# Altium schematic sheet Altium_STM32_Schematic_SchDoc.SchDoc
size A4; SheetNumber: 2; SheetTotal: 3
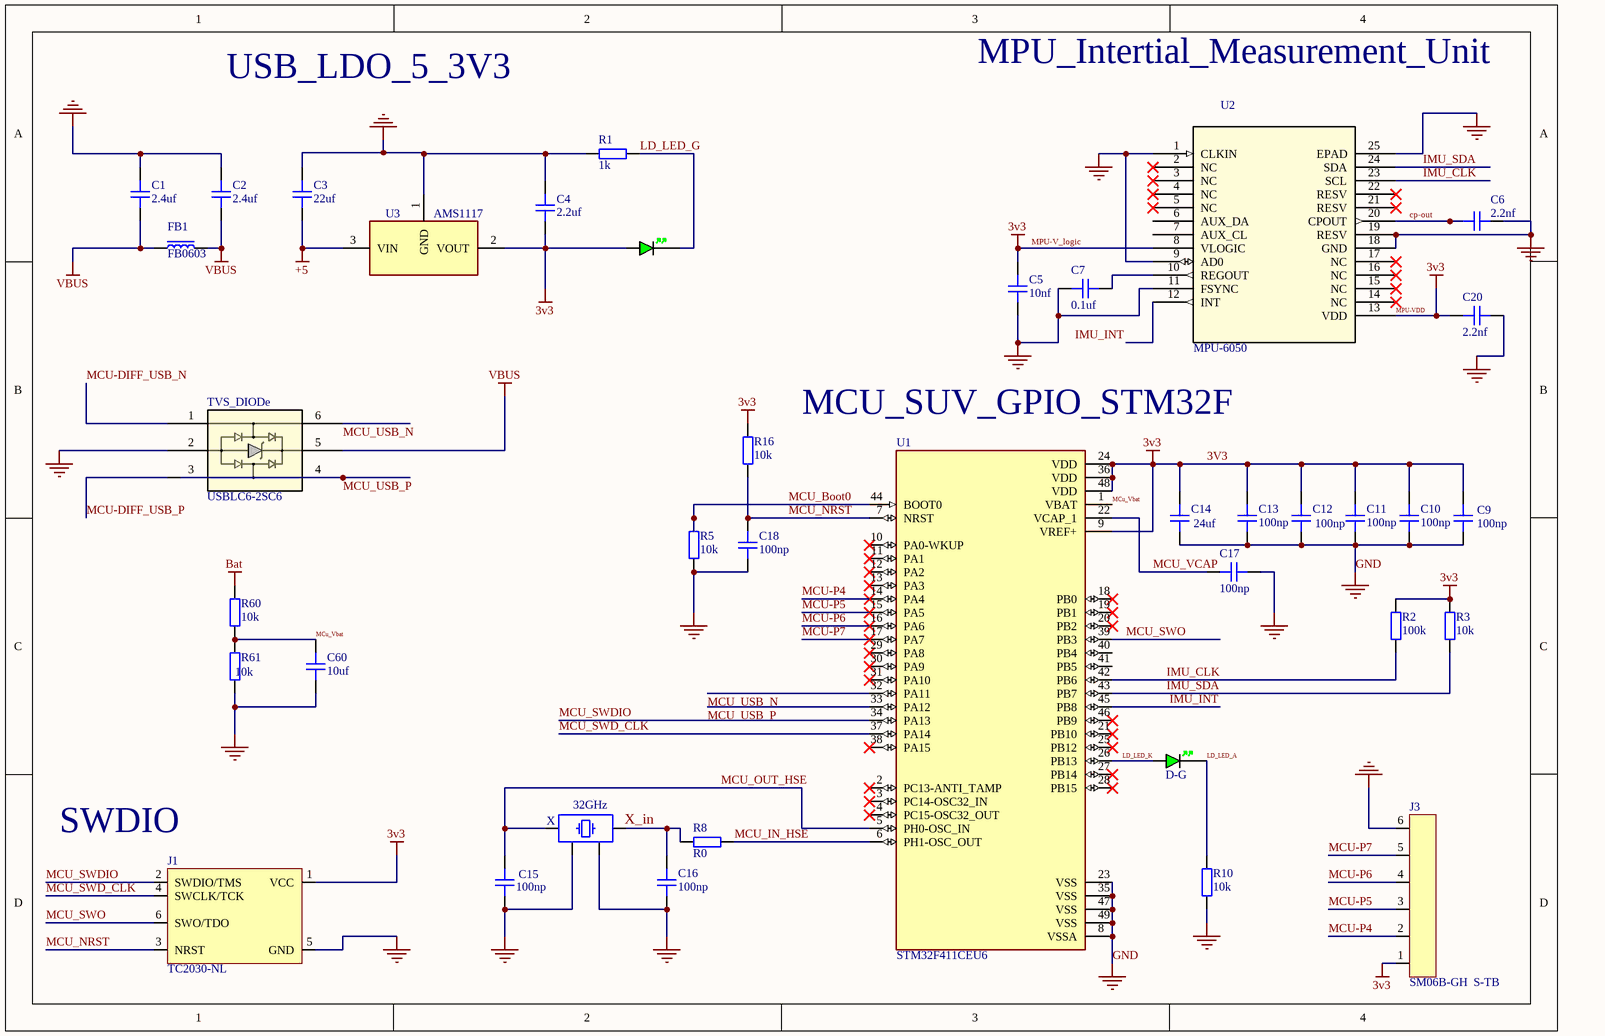
[diagram p0: Altium_STM32_Schematic_SchDoc.SchDoc]

## Parts
C1  2.4uf  [CAP_0603]
C2  2.4uf  [CAP_0603]
C3  22uf  [CAP_0805]
C4  2.2uf  [CAP_0805]
C5  10nf  [CAP_0603]
C6  2.2nf  [CAP_0603]
C7  0.1uf  [CAP_0603]
C9  100np  [CAP_0402]
C10  100np  [CAP_0402]
C11  100np  [CAP_0402]
C12  100np  [CAP_0402]
C13  100np  [CAP_0402]
C14  24uf  [CAP_0603]
C15  100np  [CAP_0402]
C16  100np  [CAP_0402]
C17  100np  [CAP_0402]
C18  100np  [CAP_0402]
C20  2.2nf  [CAP_0603]
C60  10uf  [CAP_0402]
D  GREEN  [LED_0402_GREEN]  (value not drawn)
D-G  GREEN  [LED_0402_GREEN]  (value not drawn)
FB1  FB0603  [FB_0603]
J1  TC2030-NL  [TC2030-NL-FP]  (no BOM)
J3  SM06B-GH  S-TB  [SM06B-GHS-TB]
R1  1k  [RES_0402]
R2  100k  [RES_0402]
R3  10k  [RES_0402]
R5  10k  [RES_0402]
R8  R0  [RES_0402]
R10  10k  [RES_0402]
R16  10k  [RES_0402]
R60  10k  [RES_0402]
R61  10k  [RES_0402]
TVS_DIODe  USBLC6-2SC6  [SOT23-6L_STM]
U1  STM32F411CEU6  [QFN50P700X700X60-49N]
U2  MPU-6050  [QFN24_4X4X0P9-0P5_TDK]
U3  AMS1117  [AMS1117]
X  32GHz  [XTAL_2016]

## Nets
3V3: C4.2 C5.2 C9.2 C10.2 C11.2 C12.2 C13.2 C14.2 C20.2 D.A J1.1(VCC) J3.1 R2.2 R3.2 R16.2 U1.9(VREF+) U1.24(VDD) U1.36(VDD) U1.48(VDD) U2.8(VLOGIC) U2.13(VDD) U3.2(VOUT)  [also labelled MPU-V_logic, MPU-VDD]
+5: C3.1 U3.3(VIN)
Bat: R60.2
GND: C1.2 C2.2 C3.2 C4.1 C5.1 C6.1 C7.1 C9.1 C10.1 C11.1 C12.1 C13.1 C14.1 C15.1 C16.1 C17.1 C18.2 C20.1 C60.1 J1.5(GND) J3.6 R1.1 R5.1 R10.2 R61.2 TVS_DIODe.2 U1.8(VSSA) U1.23(VSS) U1.35(VSS) U1.47(VSS) U1.49(VSS) U2.1(CLKIN) U2.9(AD0) U2.11(FSYNC) U2.18(GND) U2.19(RESV) U2.25(EPAD) U3.1(GND) X.2 X.4
VBUS: C1.1 C2.1 FB1.1 FB1.2 TVS_DIODe.5
cp-out: C6.2 U2.20(CPOUT)
IMU_CLK: R2.1 U1.42(PB6) U2.23(SCL)
IMU_INT: U1.45(PB8) U2.12(INT)
IMU_SDA: R3.1 U1.43(PB7) U2.24(SDA)
LD_LED_A: D-G.K R10.1
LD_LED_G: D.K R1.2
LD_LED_K: D-G.A U1.26(PB13)
MCU-DIFF_USB_N: TVS_DIODe.1
MCU-DIFF_USB_P: TVS_DIODe.3
MCU-P4: J3.2 U1.14(PA4)
MCU-P5: J3.3 U1.15(PA5)
MCU-P6: J3.4 U1.16(PA6)
MCU-P7: J3.5 U1.17(PA7)
MCU_Boot0: R5.2 U1.44(BOOT0)
MCU_IN_HSE: R8.2 U1.6(PH1-OSC_OUT)
MCU_NRST: C18.1 J1.3(NRST) R16.1 U1.7(NRST)
MCU_OUT_HSE: C15.2 U1.5(PH0-OSC_IN) X.1
MCU_SWD_CLK: J1.4(SWCLK/TCK) U1.37(PA14)
MCU_SWDIO: J1.2(SWDIO/TMS) U1.34(PA13)
MCU_SWO: J1.6(SWO/TDO) U1.39(PB3)
MCU_USB_N: TVS_DIODe.6 U1.32(PA11)
MCU_USB_P: TVS_DIODe.4 U1.33(PA12)
MCu_Vbat: C60.2 R60.1 R61.1 U1.1(VBAT)
MCU_VCAP: C17.2 U1.22(VCAP_1)
X_in: C16.2 R8.1 X.3
NetC7_2: C7.2 U2.10(REGOUT)

Not connected (* = marked no-connect by the designer): U1 2(PC13-ANTI_TAMP)* 3(PC14-OSC32_IN)* 4(PC15-OSC32_OUT)* 10(PA0-WKUP)* 11(PA1)* 12(PA2)* 13(PA3)* 18(PB0)* 19(PB1)* 20(PB2)* 21(PB10)* 25(PB12)* 27(PB14)* 28(PB15)* 29(PA8)* 30(PA9)* 31(PA10)* 38(PA15)* 40(PB4) 41(PB5) 46(PB9)*; U2 2(NC)* 3(NC)* 4(NC)* 5(NC)* 6(AUX_DA) 7(AUX_CL) 14(NC)* 15(NC)* 16(NC)* 17(NC)* 21(RESV)* 22(RESV)*

## Notes on the sheet
- USB_LDO_5_3V3
- MPU_Intertial_Measurement_Unit
- MCU_SUV_GPIO_STM32F
- (near J1) SWDIO

## Library data of the parts
C1 C2 C5-C7 C14 C20 = CAP_0603: Capacitor SMD 0603; Manufacturer: *; Manufacturer Part Number: *; Distributor Link: *; LCSC: *; Rating: *; Dielectric: *
C3 C4 = CAP_0805: Capacitor SMD 0805; Manufacturer: *; Manufacturer Part Number: *; Distributor Link: *; LCSC: *; Rating: *; Dielectric: *
C9-C13 C15-C18 C60 = CAP_0402: Capacitor SMD 0402; Manufacturer: *; Manufacturer Part Number: *; Distributor Link: *; LCSC: *; Rating: *; Dielectric: *
D D-G = LED_0402_GREEN: LED 0402 GREEN SMD
FB1 = FB_0603: Ferrite Bead SMD 0603; Manufacturer: *; Manufacturer Part Number: *; Distributor Link: *; LCSC: *
J1 = TC2030-NL: Tag-Connect No-Solder SWD Debug Connector (No Legs) DO NOT PLACE; Manufacturer: Tag-Connect; Manufacturer Part Number: TC2030-NL-FP
J3 = SM06B-GHS-TB: Header Connector 6 Position 1.25MM Pitch SMD Horizontal JST GH; Manufacturer: JST; Manufacturer Part Number: SM06B-GHS-TB
R1-R3 R5 R8 R10 R16 R60 R61 = RES_0402: Resistor SMD 0402; Manufacturer: *; Manufacturer Part Number: *; Distributor Link: *; LCSC: *
TVS_DIODe = USBLC6-2SC6: ESD Protection for USB 2.0 High Speed; Manufacturer_Name: STMicroelectronics; Copyright: Copyright (C) 2025 Ultra Librarian. All rights reserved.; Manufacturer_Part_Number: USBLC6-2SC6; RefDes: RefDes; Type: Type
U1 = STM32F411CEU6: High-performance access line, ARM Cortex-M4 core with DSP and FPU, 512 Kbytes Flash, 100 MHz CPU, ART Accelerator; Package: None; Availability: Unavailable; Value: *; MP: STM32F411CEU6; Price: None
U2 = MPU-6050: Description; Manufacturer_Name: TDK; Type: Motion Sensors; Copyright: Copyright (C) 2025 Ultra Librarian. All rights reserved.; Manufacturer_Part_Number: MPU-6050; RefDes: RefDes
U3 = AMS1117: IC REG LINEAR 1A SOT-89-3L; ComponentLink1Description: Datasheet; ComponentLink1URL: http://www.advanced-monolithic.com/pdf/ds1117.pdf; Digikey PN: 4518-AMS1117-3.3CT-ND; JLCPCB PN: C963410
X = XTAL_2016: Crystal SMD 4-Pin 2.0x1.6mm; Distributor Link: *